# Altium schematic sheet phantom.SchDoc
size A2
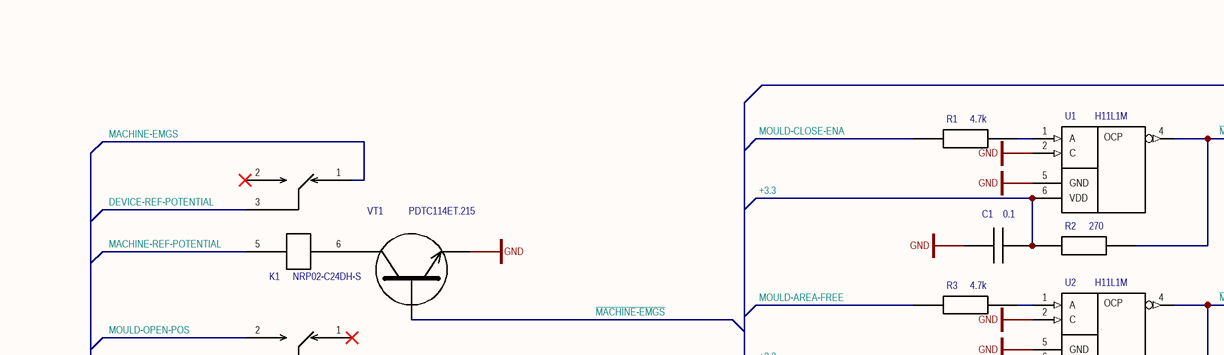
[diagram p0: phantom.SchDoc, top left]
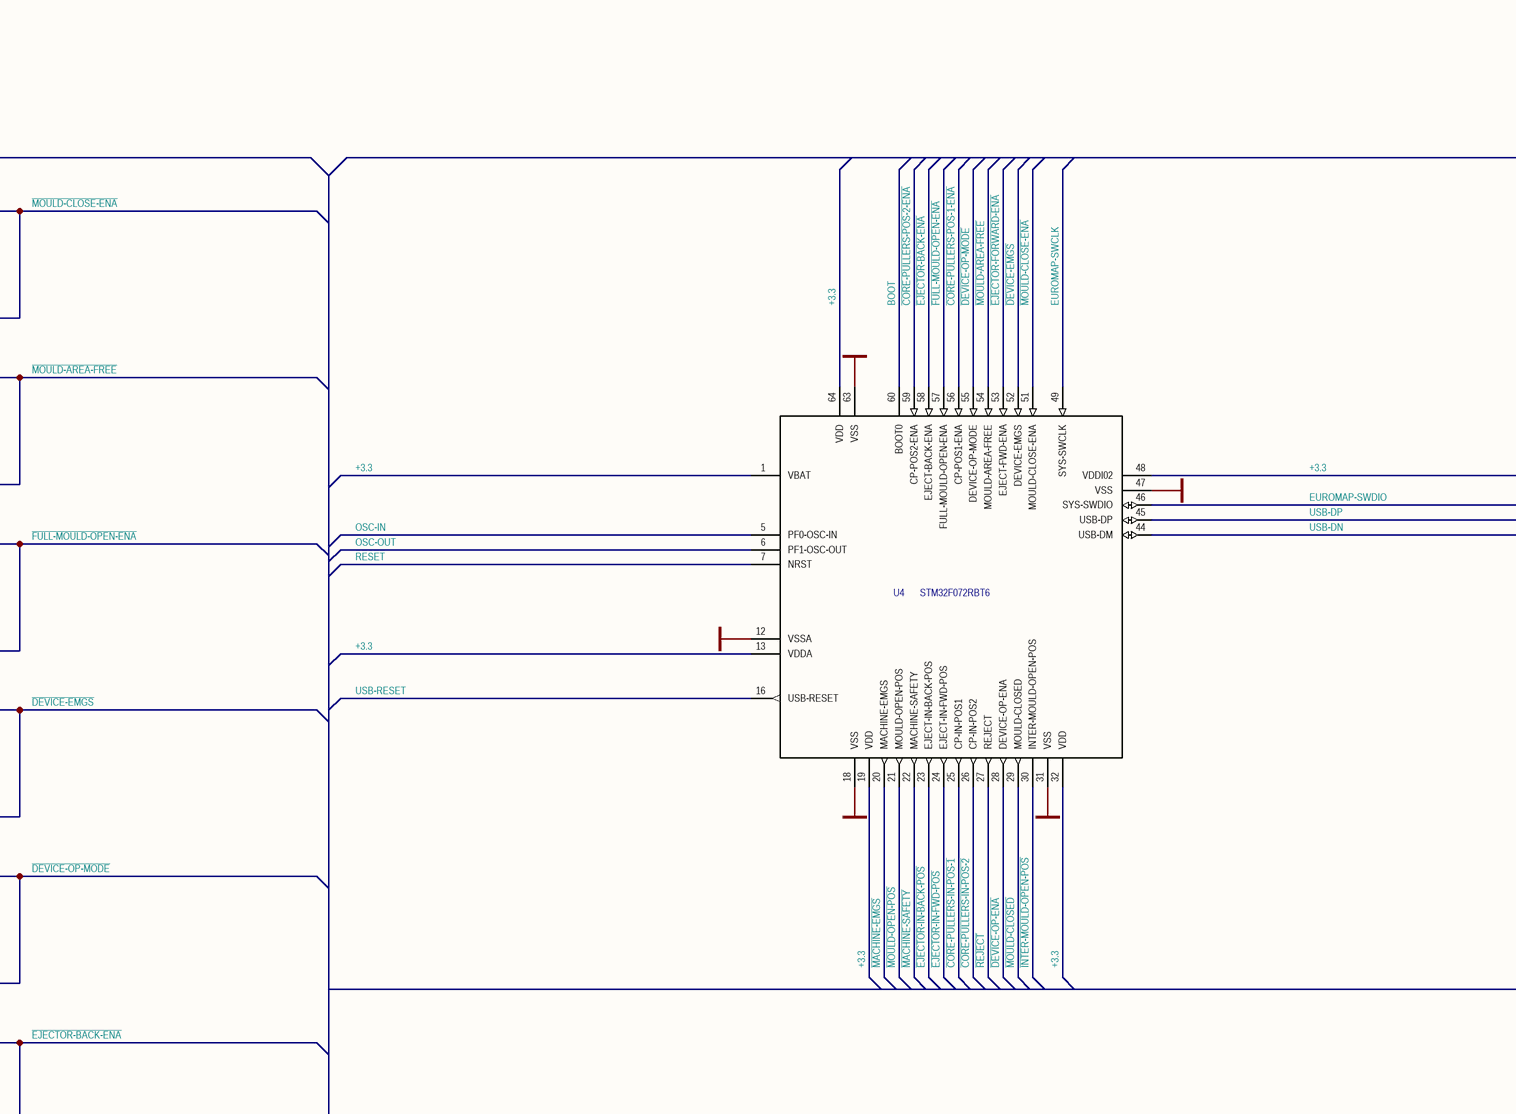
[diagram p1: phantom.SchDoc, top right]
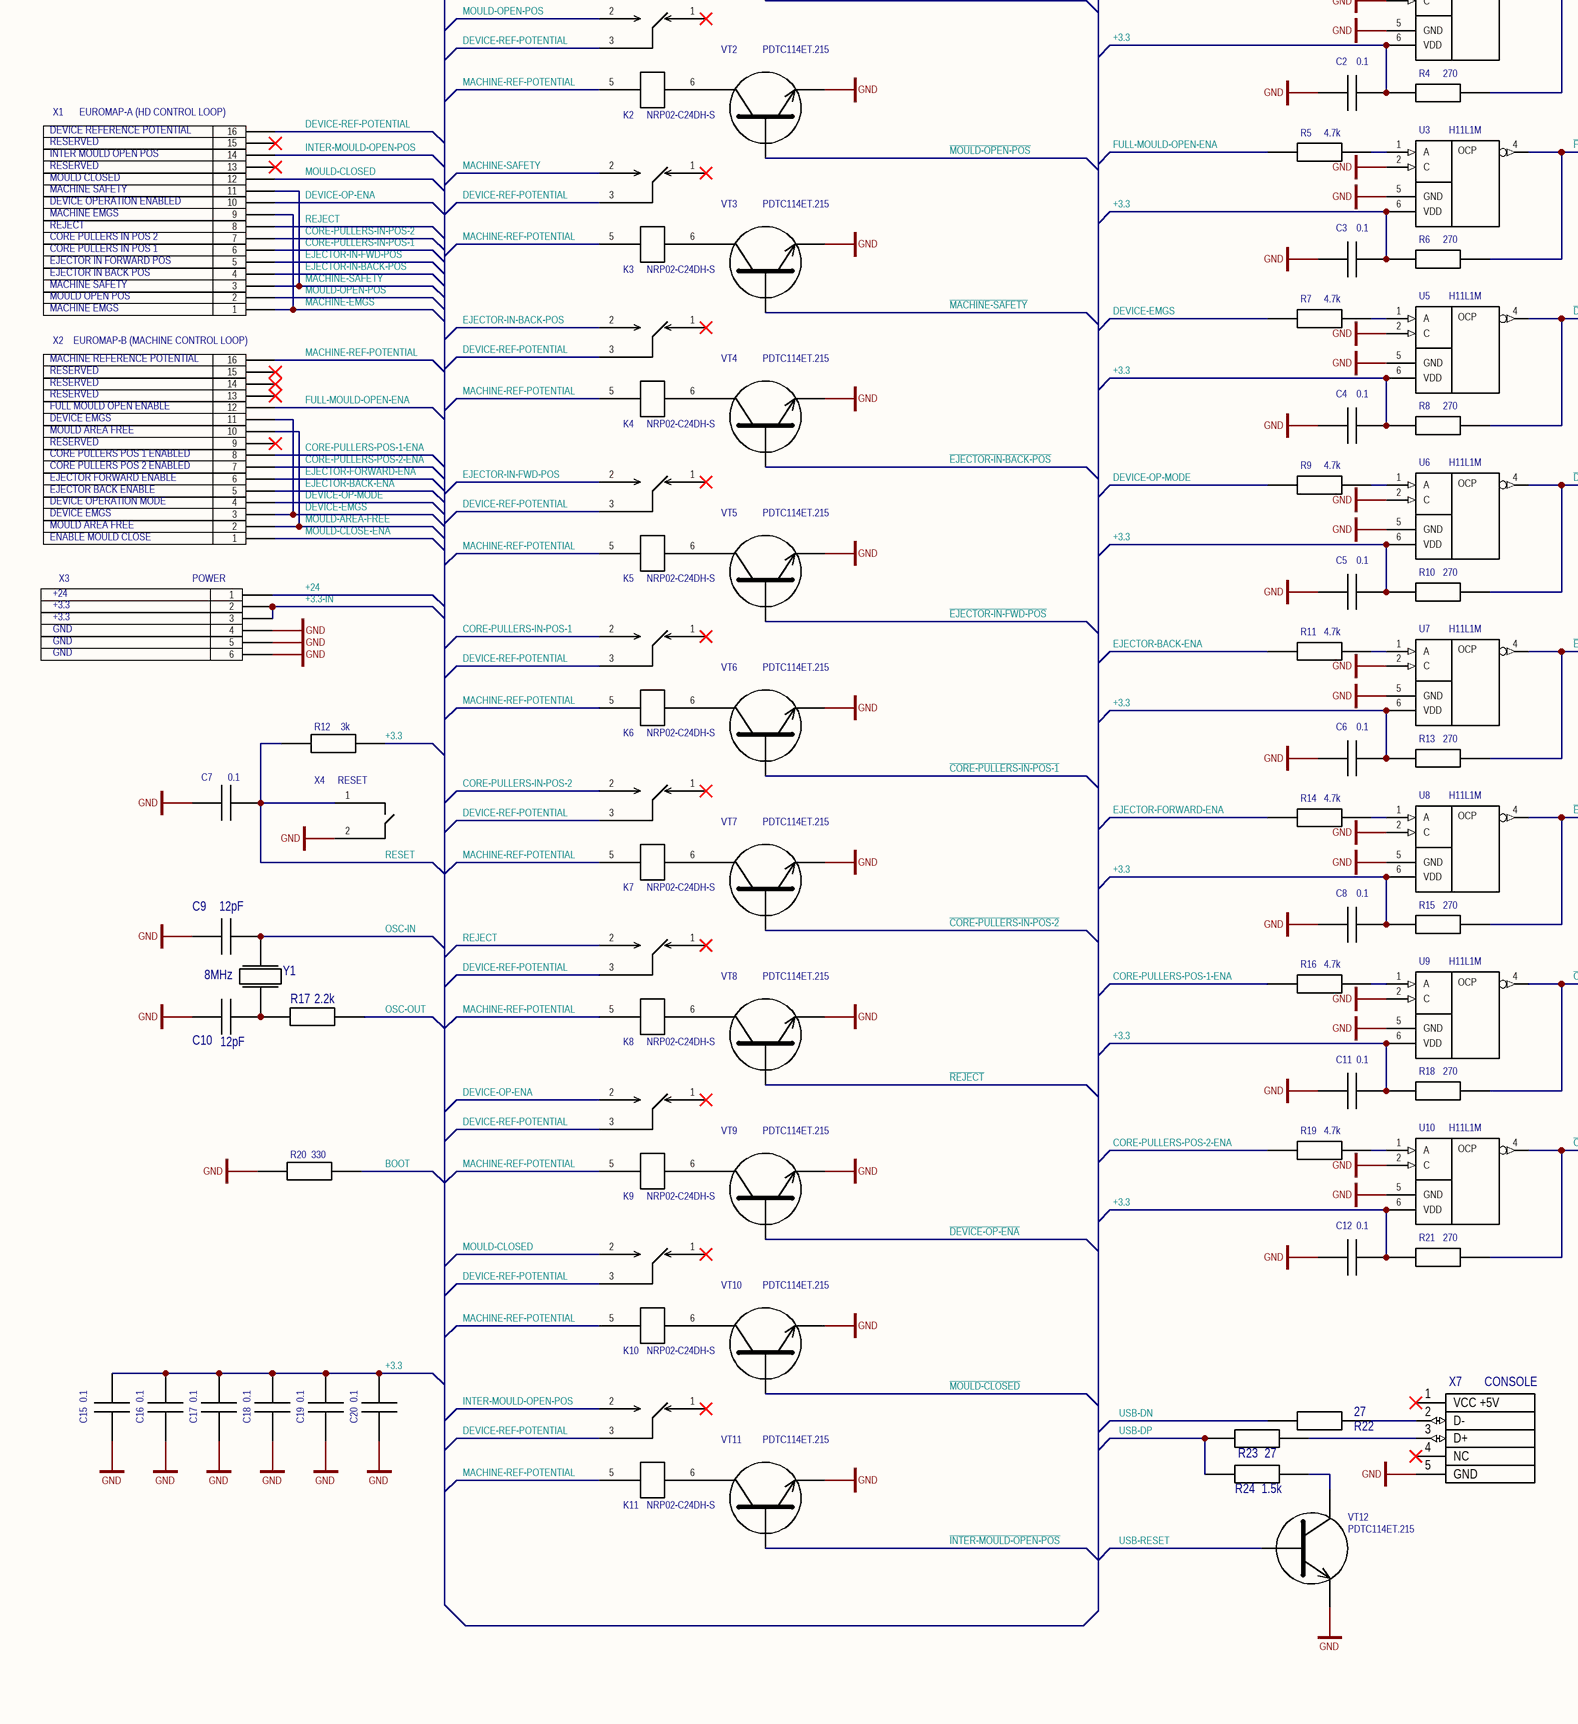
[diagram p2: phantom.SchDoc, bottom left]
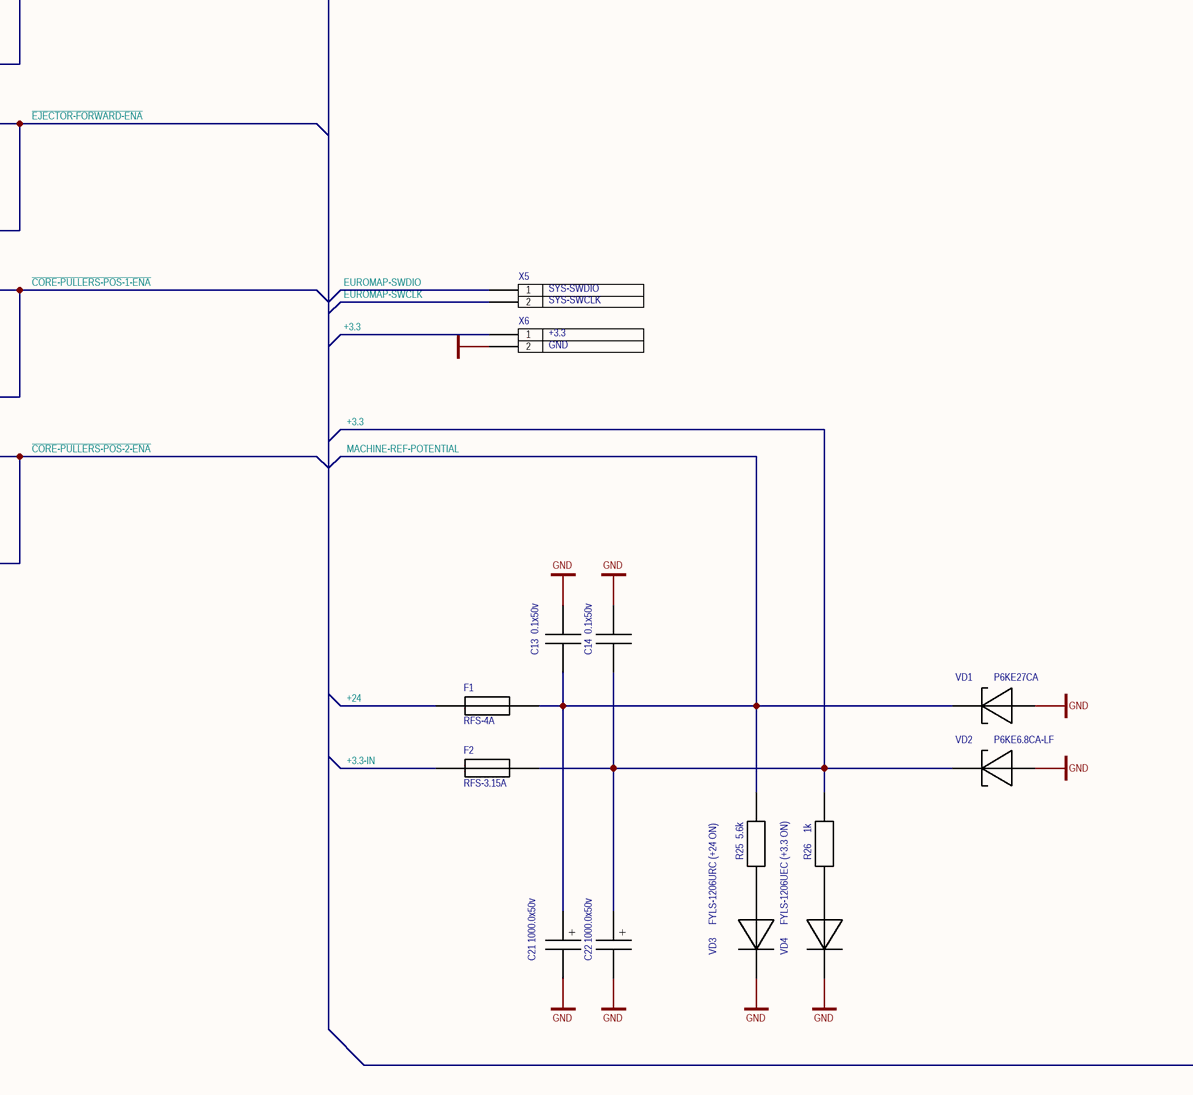
[diagram p3: phantom.SchDoc, bottom right]

## Parts
C1  0.1  [CAPC2012X04N]
C2  0.1  [CAPC2012X04N]
C3  0.1  [CAPC2012X04N]
C4  0.1  [CAPC2012X04N]
C5  0.1  [CAPC2012X04N]
C6  0.1  [CAPC2012X04N]
C7  0.1  [CAPC1608X05N]
C8  0.1  [CAPC2012X04N]
C9  12pF  [CAPC1608X05N]
C10  12pF  [CAPC1608X05N]
C11  0.1  [CAPC2012X04N]
C12  0.1  [CAPC2012X04N]
C13  0.1x50v  [CAPC3216X05N]
C14  0.1x50v  [CAPC3216X05N]
C15  0.1  [CAPC1608X05N]
C16  0.1  [CAPC1608X05N]
C17  0.1  [CAPC1608X05N]
C18  0.1  [CAPC1608X05N]
C19  0.1  [CAPC1608X05N]
C20  0.1  [CAPC1608X05N]
C21  1000.0x50v  [C-LOW-ESR-16-18]
C22  1000.0x50v  [C-LOW-ESR-16-18]
F1  RFS-4A  [MRT-FUSE]
F2  RFS-3.15A  [MRT-FUSE]
K1  NRP02-C24DH-S  [R_NRP02]
K2  NRP02-C24DH-S  [R_NRP02]
K3  NRP02-C24DH-S  [R_NRP02]
K4  NRP02-C24DH-S  [R_NRP02]
K5  NRP02-C24DH-S  [R_NRP02]
K6  NRP02-C24DH-S  [R_NRP02]
K7  NRP02-C24DH-S  [R_NRP02]
K8  NRP02-C24DH-S  [R_NRP02]
K9  NRP02-C24DH-S  [R_NRP02]
K10  NRP02-C24DH-S  [R_NRP02]
K11  NRP02-C24DH-S  [R_NRP02]
R1  4.7k  [RESC2012X04N]
R2  270  [RESC2012X04N]
R3  4.7k  [RESC2012X04N]
R4  270  [RESC2012X04N]
R5  4.7k  [RESC2012X04N]
R6  270  [RESC2012X04N]
R7  4.7k  [RESC2012X04N]
R8  270  [RESC2012X04N]
R9  4.7k  [RESC2012X04N]
R10  270  [RESC2012X04N]
R11  4.7k  [RESC2012X04N]
R12  3k  [RESC1608X05N]
R13  270  [RESC2012X04N]
R14  4.7k  [RESC2012X04N]
R15  270  [RESC2012X04N]
R16  4.7k  [RESC2012X04N]
R17  2.2k  [RESC1608X05N]
R18  270  [RESC2012X04N]
R19  4.7k  [RESC2012X04N]
R20  330  [RESC1608X05N]
R21  270  [RESC2012X04N]
R22  27  [RESC2012X04N]
R23  27  [RESC2012X04N]
R24  1.5k  [RESC2012X04N]
R25  5.6k  [RESC2012X04N]
R26  1k  [RESC2012X04N]
U1  H11L1M  [DIP6]
U2  H11L1M  [DIP6]
U3  H11L1M  [DIP6]
U4  STM32F072RBT6  [TSQFP50P1200X1200X160-64N]
U5  H11L1M  [DIP6]
U6  H11L1M  [DIP6]
U7  H11L1M  [DIP6]
U8  H11L1M  [DIP6]
U9  H11L1M  [DIP6]
U10  H11L1M  [DIP6]
VD1  P6KE27CA  [P6KE27CA]
VD2  P6KE6.8CA-LF  [P6KE27CA]
VD3  FYLS-1206URC (+24 ON)  [CAPMP3216X11N]
VD4  FYLS-1206UEC (+3.3 ON)  [CAPMP3216X11N]
VT1  PDTC114ET.215  [SOT95P238X102-3N]
VT2  PDTC114ET.215  [SOT95P238X102-3N]
VT3  PDTC114ET.215  [SOT95P238X102-3N]
VT4  PDTC114ET.215  [SOT95P238X102-3N]
VT5  PDTC114ET.215  [SOT95P238X102-3N]
VT6  PDTC114ET.215  [SOT95P238X102-3N]
VT7  PDTC114ET.215  [SOT95P238X102-3N]
VT8  PDTC114ET.215  [SOT95P238X102-3N]
VT9  PDTC114ET.215  [SOT95P238X102-3N]
VT10  PDTC114ET.215  [SOT95P238X102-3N]
VT11  PDTC114ET.215  [SOT95P238X102-3N]
VT12  PDTC114ET.215  [SOT95P238X102-3N]
X1  EUROMAP-A (HD CONTROL LOOP)  [MINI-FIT-16-WAY-M]
X2  EUROMAP-B (MACHINE CONTROL LOOP)  [MINI-FIT-16-WAY-M]
X3  POWER  [MINI-FIT-6WAY-SM]
X4  RESET  [TACT SWITCH]
X5  Jamper ZL201  [ZL201-2]  (value not drawn)
X6  Jamper ZL201  [ZL201-2]  (value not drawn)
X7  CONSOLE  [229-5FB-MINI-USB]
Y1  8MHz  [HC49LT]

## Nets
GND: C1.1 C2.1 C3.1 C4.1 C5.1 C6.1 C7.2 C8.1 C9.1 C10.1 C11.1 C12.1 C13.2 C14.2 C15.1 C16.1 C17.1 C18.1 C19.1 C20.1 C21.2 C22.2 R20.1 U1.2(C) U1.5(GND) U2.2(C) U2.5(GND) U3.2(C) U3.5(GND) U4.12(VSSA) U4.18(VSS) U4.31(VSS) U4.47(VSS) U4.63(VSS) U5.2(C) U5.5(GND) U6.2(C) U6.5(GND) U7.2(C) U7.5(GND) U8.2(C) U8.5(GND) U9.2(C) U9.5(GND) U10.2(C) U10.5(GND) VD1.A VD2.A VD3.1(C) VD4.1(C) VT1.2(E) VT2.2(E) VT3.2(E) VT4.2(E) VT5.2(E) VT6.2(E) VT7.2(E) VT8.2(E) VT9.2(E) VT10.2(E) VT11.2(E) VT12.2(E) X3.4 X3.5 X3.6 X4.2 X6.2 X7.5(GND)
+3.3: C1.2 C2.2 C3.2 C4.2 C5.2 C6.2 C8.2 C11.2 C12.2 C14.1 C15.2 C16.2 C17.2 C18.2 C19.2 C20.2 C22.1(+) F2.1 R2.1 R4.1 R6.1 R8.1 R10.1 R12.1 R13.1 R15.1 R18.1 R21.1 R26.2 U1.6(VDD) U2.6(VDD) U3.6(VDD) U4.1(VBAT) U4.13(VDDA) U4.19(VDD) U4.32(VDD) U4.48(VDDI02) U4.64(VDD) U5.6(VDD) U6.6(VDD) U7.6(VDD) U8.6(VDD) U9.6(VDD) U10.6(VDD) VD2.K X6.1
+3.3-IN: F2.2 X3.2 X3.3
+24: F1.2 X3.1
BOOT: R20.2 U4.60(BOOT0)
~{CORE-PULLERS-IN-POS-1}: U4.25(CP-IN-POS1) VT6.1(B)
~{CORE-PULLERS-IN-POS-2}: U4.26(CP-IN-POS2) VT7.1(B)
~{CORE-PULLERS-POS-1-ENA}: R18.2 U4.56(CP-POS1-ENA) U9.4(OUT)
~{CORE-PULLERS-POS-2-ENA}: R21.2 U4.59(CP-POS2-ENA) U10.4(OUT)
CORE-PULLERS-IN-POS-1: K6.2 X1.6
CORE-PULLERS-IN-POS-2: K7.2 X1.7
CORE-PULLERS-POS-1-ENA: R16.1 X2.8
CORE-PULLERS-POS-2-ENA: R19.1 X2.7
~{DEVICE-EMGS}: R8.2 U4.52(DEVICE-EMGS) U5.4(OUT)
~{DEVICE-OP-ENA}: U4.28(DEVICE-OP-ENA) VT9.1(B)
~{DEVICE-OP-MODE}: R10.2 U4.55(DEVICE-OP-MODE) U6.4(OUT)
DEVICE-EMGS: R7.1 X2.3 X2.11
DEVICE-OP-ENA: K9.2 X1.10
DEVICE-OP-MODE: R9.1 X2.4
DEVICE-REF-POTENTIAL: K1.3 K2.3 K3.3 K4.3 K5.3 K6.3 K7.3 K8.3 K9.3 K10.3 K11.3 X1.16
~{EJECTOR-BACK-ENA}: R13.2 U4.58(EJECT-BACK-ENA) U7.4(OUT)
~{EJECTOR-FORWARD-ENA}: R15.2 U4.53(EJECT-FWD-ENA) U8.4(OUT)
~{EJECTOR-IN-BACK-POS}: U4.23(EJECT-IN-BACK-POS) VT4.1(B)
~{EJECTOR-IN-FWD-POS}: U4.24(EJECT-IN-FWD-POS) VT5.1(B)
EJECTOR-BACK-ENA: R11.1 X2.5
EJECTOR-FORWARD-ENA: R14.1 X2.6
EJECTOR-IN-BACK-POS: K4.2 X1.4
EJECTOR-IN-FWD-POS: K5.2 X1.5
EUROMAP-SWCLK: U4.49(SYS-SWCLK) X5.2
EUROMAP-SWDIO: U4.46(SYS-SWDIO) X5.1
~{FULL-MOULD-OPEN-ENA}: R6.2 U3.4(OUT) U4.57(FULL-MOULD-OPEN-ENA)
FULL-MOULD-OPEN-ENA: R5.1 X2.12
~{INTER-MOULD-OPEN-POS}: U4.30(INTER-MOULD-OPEN-POS) VT11.1(B)
INTER-MOULD-OPEN-POS: K11.2 X1.14
~{MACHINE-EMGS}: U4.20(MACHINE-EMGS) VT1.1(B)
~{MACHINE-SAFETY}: U4.22(MACHINE-SAFETY) VT3.1(B)
~{MOULD-AREA-FREE}: R4.2 U2.4(OUT) U4.54(MOULD-AREA-FREE)
~{MOULD-CLOSE-ENA}: R2.2 U1.4(OUT) U4.51(MOULD-CLOSE-ENA)
~{MOULD-CLOSED}: U4.29(MOULD-CLOSED) VT10.1(B)
~{MOULD-OPEN-POS}: U4.21(MOULD-OPEN-POS) VT2.1(B)
MACHINE-EMGS: K1.1 X1.1 X1.9
MACHINE-REF-POTENTIAL: C13.1 C21.1(+) F1.1 K1.5 K2.5 K3.5 K4.5 K5.5 K6.5 K7.5 K8.5 K9.5 K10.5 K11.5 R25.2 VD1.K X2.16
MACHINE-SAFETY: K3.2 X1.3 X1.11
MOULD-AREA-FREE: R3.1 X2.2 X2.10
MOULD-CLOSE-ENA: R1.1 X2.1
MOULD-CLOSED: K10.2 X1.12
MOULD-OPEN-POS: K2.2 X1.2
OSC-IN: C9.2 U4.5(PF0-OSC-IN) Y1.2
OSC-OUT: R17.2 U4.6(PF1-OSC-OUT)
~{REJECT}: U4.27(REJECT) VT8.1(B)
REJECT: K8.2 X1.8
RESET: C7.1 R12.2 U4.7(NRST) X4.1
USB-DN: R22.1 U4.44(USB-DM)
USB-DP: R23.1 R24.2 U4.45(USB-DP)
USB-RESET: U4.16(USB-RESET) VT12.1(B)
NetC10_2: C10.2 R17.1 Y1.1
NetK1_6: K1.6 VT1.3(C)
NetK2_6: K2.6 VT2.3(C)
NetK3_6: K3.6 VT3.3(C)
NetK4_6: K4.6 VT4.3(C)
NetK5_6: K5.6 VT5.3(C)
NetK6_6: K6.6 VT6.3(C)
NetK7_6: K7.6 VT7.3(C)
NetK8_6: K8.6 VT8.3(C)
NetK9_6: K9.6 VT9.3(C)
NetK10_6: K10.6 VT10.3(C)
NetK11_6: K11.6 VT11.3(C)
NetR1_2: R1.2 U1.1(A)
NetR3_2: R3.2 U2.1(A)
NetR5_2: R5.2 U3.1(A)
NetR7_2: R7.2 U5.1(A)
NetR9_2: R9.2 U6.1(A)
NetR11_2: R11.2 U7.1(A)
NetR14_2: R14.2 U8.1(A)
NetR16_2: R16.2 U9.1(A)
NetR19_2: R19.2 U10.1(A)
NetR22_2: R22.2 X7.2(D-)
NetR23_2: R23.2 X7.3(D+)
NetR24_1: R24.1 VT12.3(C)
NetR25_1: R25.1 VD3.2(A)
NetR26_1: R26.1 VD4.2(A)

Not connected (* = marked no-connect by the designer): K1 2*; K2 1*; K3 1*; K4 1*; K5 1*; K6 1*; K7 1*; K8 1*; K9 1*; K10 1*; K11 1*; U4 2(PC13) 3(PC14-OSC32-IN) 4(PC15-OSC32-OUT) 8(PC0) 9(PC1) 10(PC2) 11(PC3) 14(PA0) 15(PA1) 17(PA3) 33(PB12) 34(PB13) 35(PB14) 36(PB15) 37(PC6) 38(PC7) 39(PC8) 40(PC9) 41(USB-RESET) 42(PA9) 43(PA10) 50(PA15) 61(PB8) 62(PB9); X1 13* 15*; X2 9* 13* 14* 15*; X7 1(VCC_+5V)* 4(NC)*

## Notes on the sheet
- INTER MOULD OPEN POS
- (near X1) DEVICE REFERENCE POTENTIAL
- RESERVED
- MACHINE EMGS
- MACHINE SAFETY
- REJECT
- DEVICE OPERATION ENABLED
- MOULD CLOSED
- MOULD OPEN POS
- EJECTOR IN BACK POS
- EJECTOR IN FORWARD POS
- CORE PULLERS IN POS 1
- CORE PULLERS IN POS 2
- MACHINE REFERENCE POTENTIAL
- MOULD AREA FREE
- DEVICE EMGS
- (near X2) CORE PULLERS POS 1 ENABLED
- FULL MOULD OPEN ENABLE
- DEVICE OPERATION MODE
- EJECTOR BACK ENABLE
- EJECTOR FORWARD ENABLE
- (near X2) CORE PULLERS POS 2 ENABLED
- ENABLE MOULD CLOSE
- +24
- +3.3
- GND
- SYS-SWDIO
- SYS-SWCLK
- (in symbol H11L1M) OCP

## Library data of the parts
C1-C20 = C: SMD конденсатор; Ref: http://www.kosmodrom.com.ua/prodlist.php?name=cap1206
C21 C22 = C-LOW-ESR-RADIAL: Выводной электролит
F1 F2 = FUSE: Вставка плавкая; Ref: http://www.kosmodrom.com.ua/el.php?name=RFT-2.5A
K1-K11 = NRP02-C24DH-S: Электромеханическое реле
R1-R26 = R: SMD резистор; Ref: http://www.kosmodrom.com.ua/prodlist.php?name=res1206
U1-U3 U5-U10 = H11L1M: Fairchild H11L1M Schmitt Trigger Output Optocoupler; Ref: http://www.kosmodrom.com.ua/el.php?name=H11L1M
U4 = STM32F072RBT6: Микроконтроллер
VD1 VD2 = P6KE27CA: Cупрессор; Ref: https://prom.ua/p207053054-p6ke27ca;all.html
VD3 VD4 = FYLS-1206: Светодиод; Ref: http://www.kosmodrom.com.ua/prodlist.php?page=0&name=FYLS-1206&okbutton=%CF%EE%E8%F1%EA+%EF%EE+%F1%EA%EB%E0%E4%F3
VT1-VT12 = PDTC114ET.215: NPN transistor with bias circuit
X1 X2 = MINI-FIT-16-WAY-M
X3 = MINI-FIT-6-WAY-M
X4 = TACT SWITCH
X7 = USB-MINI: Разъем USB-B розетка; Ref: http://www.kosmodrom.com.ua/el.php?name=229-5FB
Y1 = CERAMIC-RESONATOR: Кварцевый резонатор; Ref( 8MHz): http://www.kosmodrom.com.ua/el.php?name=KX-13-8.0-MHz; Ref (6MHz): http://www.kosmodrom.com.ua/el.php?name=KX-13%206.0%20MHz